# Altium schematic sheet LED Driver.SchDoc
size Letter; Organization: Altium Limited; Address1: L3, 12a Rodborough Rd; Address2: Frenchs Forest; Address3: NSW; Address4: Australia 2086
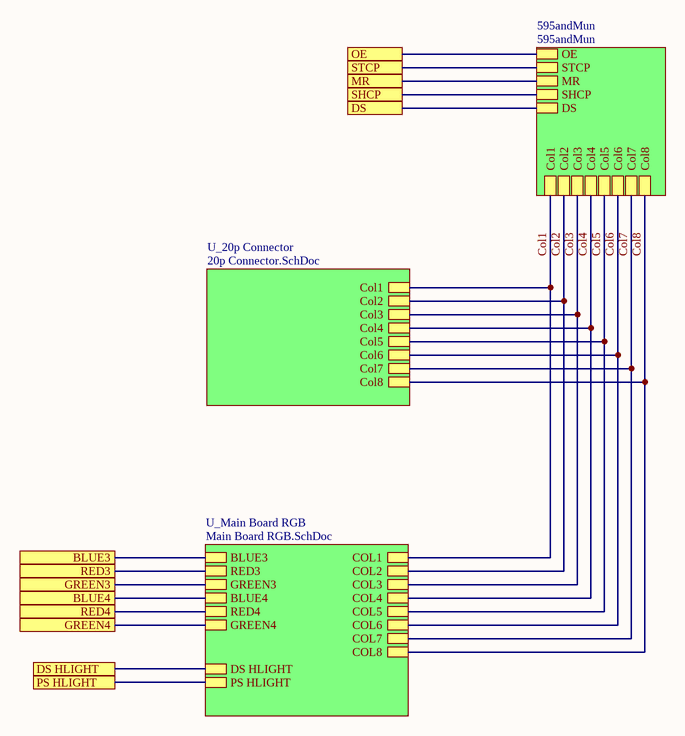
[diagram p0: LED Driver.SchDoc]

## Sub-sheets
595andMun = 595andMun: Col1, Col2, Col3, Col4, Col5, Col6, Col7, Col8, OE, STCP, MR, SHCP, DS
U_20p Connector = 20p Connector.SchDoc: Col1, Col3, Col2, Col4, Col5, Col8, Col6, Col7
U_Main Board RGB = Main Board RGB.SchDoc: BLUE3, RED3, GREEN3, BLUE4, RED4, GREEN4, COL1, COL2, COL3, COL4, COL5, COL6, COL7, COL8, DS HLIGHT, PS HLIGHT

## Ports
BLUE3, BLUE4, DS, DS HLIGHT, GREEN3, GREEN4, MR, OE, PS HLIGHT, RED3, RED4, SHCP, STCP

## Nets
BLUE3: port BLUE3, sheet U_Main Board RGB/BLUE3
BLUE4: port BLUE4, sheet U_Main Board RGB/BLUE4
Col1: sheet 595andMun/Col1, sheet U_20p Connector/Col1, sheet U_Main Board RGB/COL1
Col2: sheet 595andMun/Col2, sheet U_20p Connector/Col2, sheet U_Main Board RGB/COL2
Col3: sheet 595andMun/Col3, sheet U_20p Connector/Col3, sheet U_Main Board RGB/COL3
Col4: sheet 595andMun/Col4, sheet U_20p Connector/Col4, sheet U_Main Board RGB/COL4
Col5: sheet 595andMun/Col5, sheet U_20p Connector/Col5, sheet U_Main Board RGB/COL5
Col6: sheet 595andMun/Col6, sheet U_20p Connector/Col6, sheet U_Main Board RGB/COL6
Col7: sheet 595andMun/Col7, sheet U_20p Connector/Col7, sheet U_Main Board RGB/COL7
Col8: sheet 595andMun/Col8, sheet U_20p Connector/Col8, sheet U_Main Board RGB/COL8
DS: port DS, sheet 595andMun/DS
DS HLIGHT: port DS HLIGHT, sheet U_Main Board RGB/DS HLIGHT
GREEN3: port GREEN3, sheet U_Main Board RGB/GREEN3
GREEN4: port GREEN4, sheet U_Main Board RGB/GREEN4
MR: port MR, sheet 595andMun/MR
OE: port OE, sheet 595andMun/OE
PS HLIGHT: port PS HLIGHT, sheet U_Main Board RGB/PS HLIGHT
RED3: port RED3, sheet U_Main Board RGB/RED3
RED4: port RED4, sheet U_Main Board RGB/RED4
SHCP: port SHCP, sheet 595andMun/SHCP
STCP: port STCP, sheet 595andMun/STCP

## Notes on the sheet
- Title
- Size:
- Date:
- Letter
- Number:
- Time:
- Revision:
- Sheet
- of
- Copyright 2019
- Specialized Solutions LLC
- 206 W Lincoln Hwy STE B
- New Haven, IN 46774
- www.specsolns.com <http://www.specsolns.com>
- File: